# Altium schematic sheet Pulse_Generator.SchDoc
size A3; SheetNumber: 4; SheetTotal: 4
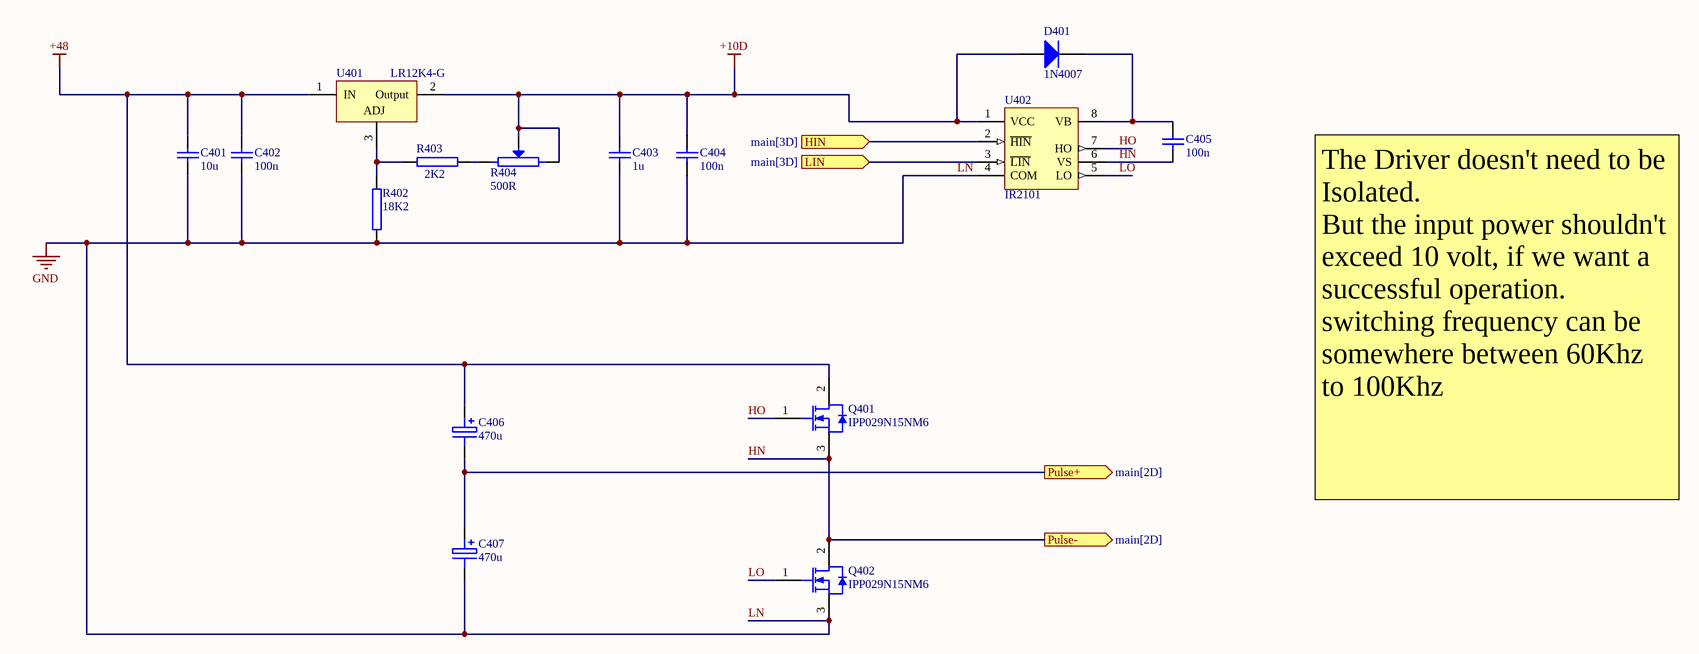
[diagram p0: Pulse_Generator.SchDoc]

## Parts
C401  10u  [CAP_1206]
C402  100n  [CAP_1206]
C403  1u  [CAP_1206]
C404  100n  [CAP_1206]
C405  100n  [RAD-0.2_AUT]
C406  470u  [CAPP300-600_AUT]
C407  470u  [CAPP300-600_AUT]
D401  1N4007  [DIODE0.4_AUT]
Q401  IPP029N15NM6  [TO-220V]
Q402  IPP029N15NM6  [TO-220V]
R402  18K2  [RES_1206]
R403  2K2  [RES_1206]
R404  500R  [3296W]
U401  LR12K4-G  [D PAK (TO-252-3)]
U402  IR2101  [DIP8_AUT]

## Ports
HIN (in, see main[3D]), LIN (in, see main[3D]), Pulse+ (out, see main[2D]), Pulse- (out, see main[2D])

## Nets
+10D: C403.2 C404.2 D401.A R404.2(BOT) R404.W(TAP) U401.2(Output) U402.1(VCC)
+48: C401.2 C402.2 C406.1 Q401.2(D) U401.1(IN)
LN: C401.1 C402.1 C403.1 C404.1 C407.2 Q402.3(S) R402.1 U402.4(COM)  [also labelled GND]
HIN: U402.2(~{HIN}) ; port HIN
HN: C405.1 Q401.3(S) Q402.2(D) U402.6(VS) ; port Pulse-
HO: Q401.1(G) U402.7(HO)
LIN: U402.3(~{LIN}) ; port LIN
LO: Q402.1(G) U402.5(LO)
Pulse+: C406.2 C407.1 ; port Pulse+
NetC405_2: C405.2 D401.K U402.8(VB)
NetR402_2: R402.2 R403.2 U401.3(ADJ)
NetR403_1: R403.1 R404.1(TOP)

## Notes on the sheet
- The Driver doesn't need to be Isolated.
  But the input power shouldn't exceed 10 volt, if we want a successful operation.
  switching frequency can be somewhere between 60Khz to 100Khz

## Library data of the parts
C401-C404 = CAPN 1206: Non Polarized Capacitor, SMD, 1206
C405 = CAPN RAD0.2: Non Polarized Capacitor, Multilayer Ceramic Dipped Radial, Pitch 200mil
C406 C407 = CAPP300-600: Polarized Aluminum Capacitor, Through Hole, Pitch 300mil, Body 600mil (Dia)
D401 = 1N4007: Diode, Standard, 1A, 1000v; Supplier 1: Farnell; Supplier Part Number 1: 9549129
Q401 = FQP65N06: Insulated-Gate Field-Effect Transistor (IGFET), N-Channel, Enhancement, Body Diode, Pin 1 Gate, 2 Drain, 3 Source, 3 Pins- Through Hole TO-220-3
Q402 = FQP65N06: Insulated-Gate Field-Effect Transistor (IGFET), N-Channel, Enhancement, Body Diode, Pin 1 Gate, 2 Drain, 3 Source, 3 Pins - Through Hole TO-220-3
R402 R403 = Resistor 1206: Resistor, SMD, 1206
R404 = 3296W-1-104LF: 3296W Series, 3/8 ” Square Potentiometer, 100k, 10%,  0.5 Watts, Multi Turn / Part #: PV36W501C01B00; Supplier 1: Farnell; Supplier Part Number 1: 9353194
U401 = LR12K4-G: Adj Positive Regulator / Linear. 12V dropout V. / 2W
U402 = IR2101_DIP: Half - Bridge Driver, MOSFET/IGBT, DIP8; Supplier 1: Farnell; Supplier Part Number 1: 8638829